# EAGLE design dualScaleBoard_HX711 (EAGLE 9.6.2)
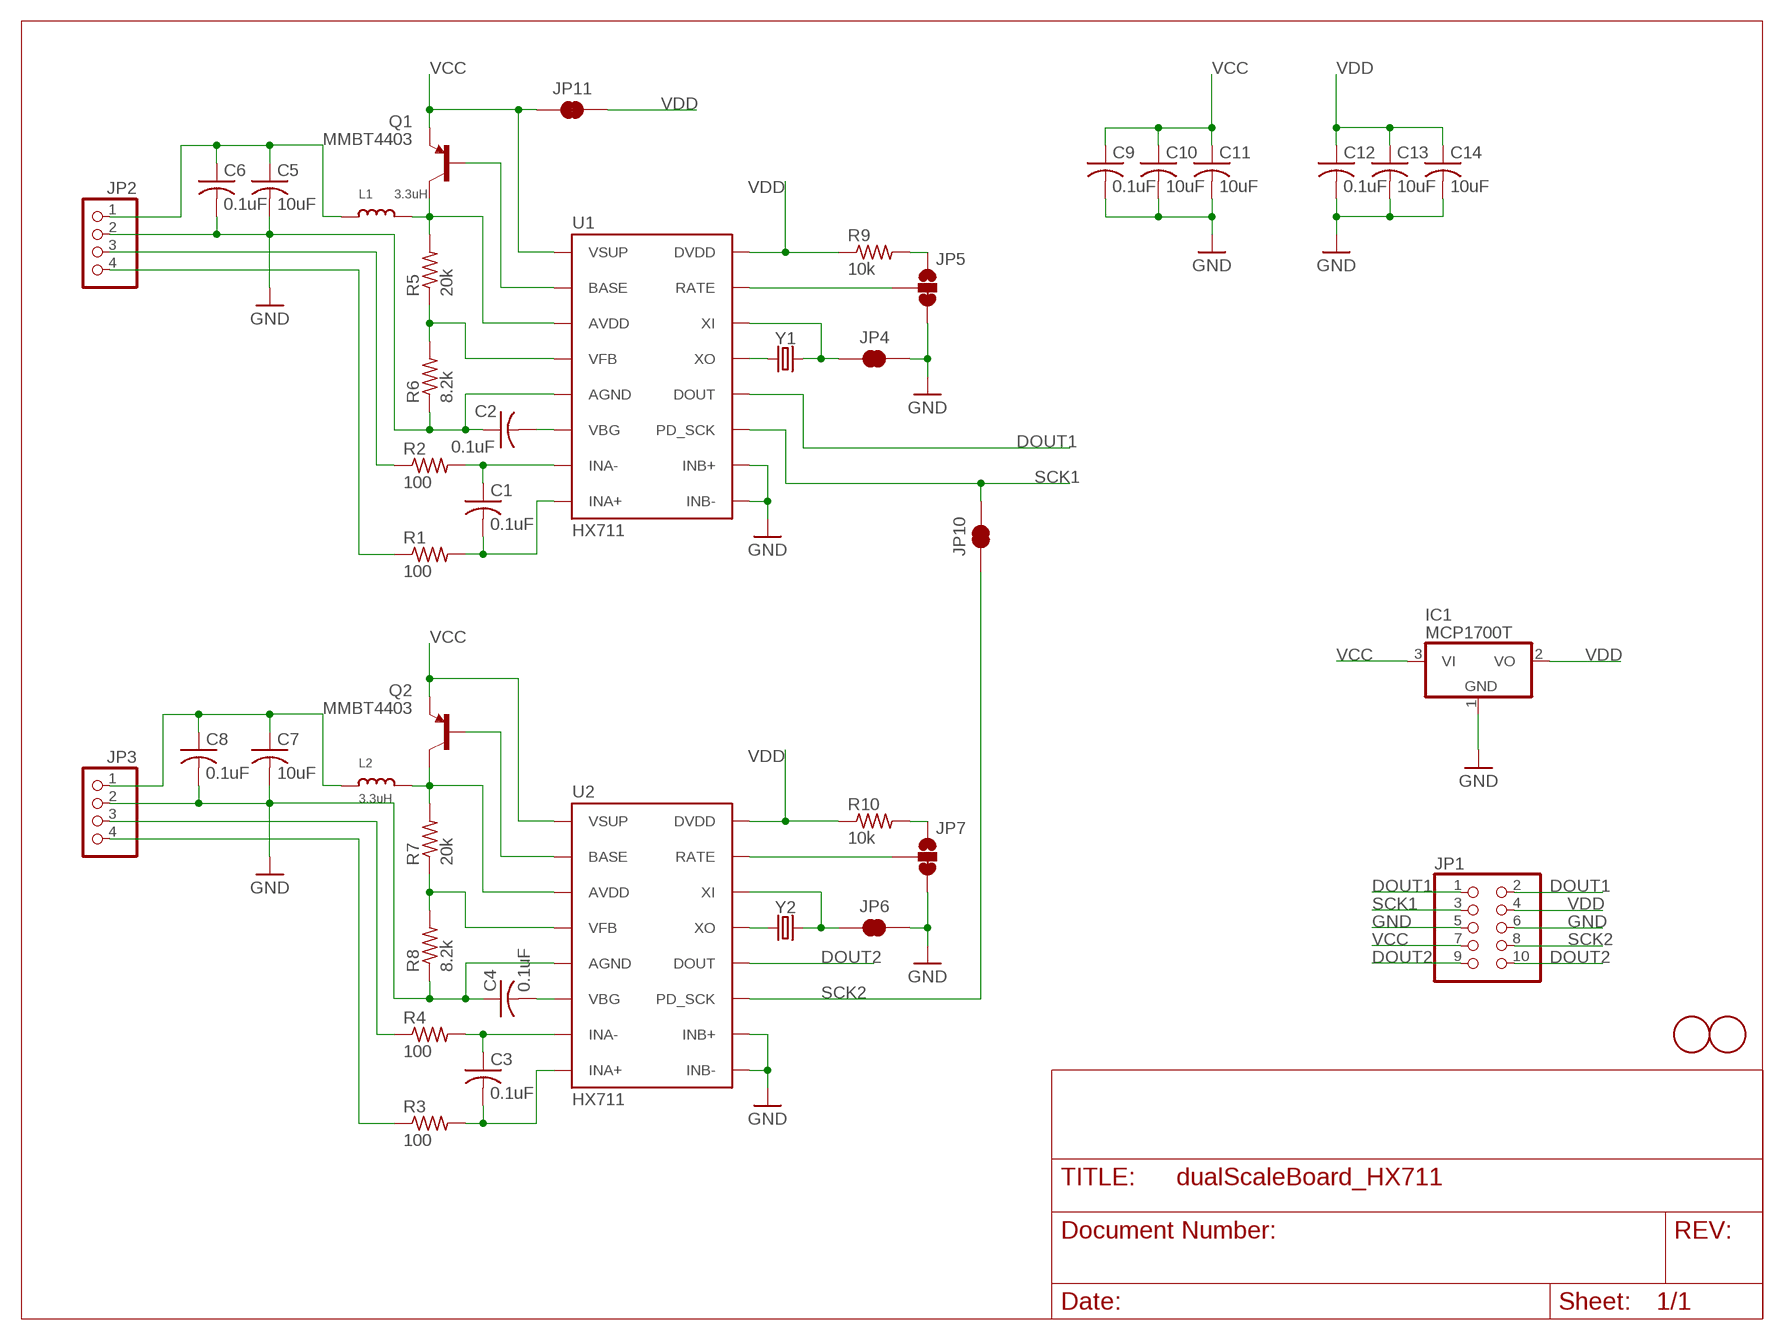
[diagram p0: schematic, sheet 1]

## Parts
C1  0.1uF  C-USC0603  [C0603]
C2  0.1uF  C-USC0603  [C0603]
C3  0.1uF  C-USC0603  [C0603]
C4  0.1uF  C-USC0603  [C0603]
C5  10uF  C-USC0603  [C0603]
C6  0.1uF  C-USC0603  [C0603]
C7  10uF  C-USC0603  [C0603]
C8  0.1uF  C-USC0603  [C0603]
C9  0.1uF  C-USC0603  [C0603]
C10  10uF  C-USC0603  [C0603]
C11  10uF  C-USC0603  [C0603]
C12  0.1uF  C-USC0603  [C0603]
C13  10uF  C-USC0603  [C0603]
C14  10uF  C-USC0603  [C0603]
IC1  MCP1700T  MCP1703CB  [SOT23]
JP1  PINHD-2X5  [2X05]
JP2  PINHD-1X4  [1X04]
JP3  PINHD-1X4  [1X04]
JP4  JUMPER-SMT_2_NC_TRACE_SILK  [SMT-JUMPER_2_NC_TRACE_SILK]
JP5  JUMPER-SMT_3_1-NC_TRACE_SILK  [SMT-JUMPER_3_1-NC_TRACE_SILK]
JP6  JUMPER-SMT_2_NC_TRACE_SILK  [SMT-JUMPER_2_NC_TRACE_SILK]
JP7  JUMPER-SMT_3_1-NC_TRACE_SILK  [SMT-JUMPER_3_1-NC_TRACE_SILK]
JP10  JUMPER-SMT_2_NC_TRACE_SILK  [SMT-JUMPER_2_NC_TRACE_SILK]
JP11  JUMPER-SMT_2_NC_TRACE_SILK  [SMT-JUMPER_2_NC_TRACE_SILK]
L1  3.3uH  INDUCTOR_0603  [_0603]
L2  3.3uH  INDUCTOR_0603  [_0603]
Q1  MMBT4403  TRANSISTOR_PNPMMBT4403  [SOT23-3]
Q2  MMBT4403  TRANSISTOR_PNPMMBT4403  [SOT23-3]
R1  100  R-US_R0402  [R0402]
R2  100  R-US_R0402  [R0402]
R3  100  R-US_R0402  [R0402]
R4  100  R-US_R0402  [R0402]
R5  20k  R-US_R0402  [R0402]
R6  8.2k  R-US_R0402  [R0402]
R7  20k  R-US_R0402  [R0402]
R8  8.2k  R-US_R0402  [R0402]
R9  10k  R-US_R0402  [R0402]
R10  10k  R-US_R0402  [R0402]
U1  HX711  [SO16]
U2  HX711  [SO16]
U$1  FIDUCIAL  [FIDUCIAL_1MM]
U$2  FIDUCIAL  [FIDUCIAL_1MM]
Y1  CRYSTALSMD-5X3.2-4PAD  [CRYSTAL-SMD-5X3.2-4PAD]
Y2  CRYSTALSMD-5X3.2-4PAD  [CRYSTAL-SMD-5X3.2-4PAD]

## Nets
DOUT1: JP1.1 JP1.2 U1.12(DOUT)
DOUT2: JP1.9 JP1.10 U2.12(DOUT)
GND: C2.1 C4.1 C5.2 C6.2 C7.2 C8.2 C9.2 C10.2 C11.2 C12.2 C13.2 C14.2 IC1.1(GND) JP1.5 JP1.6 JP2.2 JP3.2 JP4.2 JP5.3 JP6.2 JP7.3 R6.1 R8.1 U1.5(AGND) U1.9(INB-) U1.10(INB+) U2.5(AGND) U2.9(INB-) U2.10(INB+)
N$1: C2.2 U1.6(VBG)
N$2: R5.1 R6.2 U1.4(VFB)
N$3: L1.2 Q1.3(C) R5.2 U1.3(AVDD)
N$4: C1.1 R2.2 U1.7(INA-)
N$5: Q1.1(B) U1.2(BASE)
N$6: C1.2 R1.2 U1.8(INA+)
N$7: JP2.3 R2.1
N$8: JP2.4 R1.1
N$9: C5.1 C6.1 JP2.1 L1.1
N$10: C3.1 R4.2 U2.7(INA-)
N$11: C3.2 R3.2 U2.8(INA+)
N$12: U1.13(XO) Y1.1
N$13: C4.2 U2.6(VBG)
N$14: R7.1 R8.2 U2.4(VFB)
N$15: C7.1 C8.1 JP3.1 L2.1
N$16: L2.2 Q2.3(C) R7.2 U2.3(AVDD)
N$17: JP3.3 R4.1
N$18: Q2.1(B) U2.2(BASE)
N$19: JP3.4 R3.1
N$20: U2.13(XO) Y2.1
N$21: JP4.1 U1.14(XI) Y1.3
N$23: JP5.2 U1.15(RATE)
N$24: JP5.1 R9.2
N$26: JP6.1 U2.14(XI) Y2.3
N$27: JP7.2 U2.15(RATE)
N$28: JP7.1 R10.2
SCK1: JP1.3 JP10.2 U1.11(PD_SCK)
SCK2: JP1.8 JP10.1 U2.11(PD_SCK)
VCC: C9.1 C10.1 C11.1 IC1.3(VI) JP1.7 JP11.1 Q1.2(E) Q2.2(E) U1.1(VSUP) U2.1(VSUP)
VDD: C12.1 C13.1 C14.1 IC1.2(VO) JP1.4 JP11.2 R9.1 R10.1 U1.16(DVDD) U2.16(DVDD)

## Library data of the parts
C1-C4 C6 C8 C9 C12 = rcl:C-US: CAPACITOR, American symbol; LCSC: C1591; SPICEPREFIX: C
C5 C7 C10 C11 C13 C14 = rcl:C-US: CAPACITOR, American symbol; LCSC: C19702; SPICEPREFIX: C
IC1 = linear:MCP1703: 250 mA, 16V, Low Quiescent Current LDO Regulator Source: http://ww1.microchip.com/downloads/en/DeviceDoc/22049b.pdf; LCSC: C39051
JP1 = pinhead:PINHD-2X5: PIN HEADER
JP2 JP3 = pinhead:PINHD-1X4: PIN HEADER
JP4 JP6 JP10 JP11 = SparkFun-Jumpers:JUMPER-SMT_2_NC_TRACE: Normally closed trace jumper This jumper has a trace between two pads so it's normally closed (NC). Use a razor knife to open the connection. For best results follow the IPC guidelines for cutting traces: Cutout at least 0.063 mm (0.005 in). Remove all loose material to clean up the cut area. Seal the cut with an approved epoxy. Reapply solder to reclose the connection.
JP5 JP7 = SparkFun-Jumpers:JUMPER-SMT_3_1-NC_TRACE: Normally closed trace jumper (1 of 2 connections) This jumper has a trace between two pads so it's normally closed (NC). The other connection is normally open (NO). Use a razor knife to open the connection. For best results follow the IPC guidelines for cutting traces: Cutout at least 0.063 mm (0.005 in). Remove all loose material to clean up the cut area. Seal the cut with an approved epoxy. Reapply solder to reclose the connection, or to close the NO connection.
L1 L2 = microbuilder:INDUCTOR: Inductors 0603: 10nH Ceramic Inductor - microwire antenna/RF (Digikey: 712-1434-2-ND) 0805: 560nH Ceramic Inductor - RF (Digikey: 553-1047-1-ND) 270nH Ceramic Inductor - Q = 40@250MHz, +-5%, 1 Ohm DC Resistance (Digikey: 535-10506-2-ND) 1007 (2518 Metric) SMT: 10µH 10% 250mOhm 820mA 1007 Inductor (Digikey: 587-2189-1-ND) 22µH 10% 500mOhm 580mA 1007 Inductor (Digikey: 587-2190-1-ND) 47µH 10% 950mOhm 420mA 1007 Inductor (Digikey: 587-2191-1-ND) 47µH 5% 100mOhm 1A 1008 Inductor (Digikey: 732-1816-1-ND) 5.0x5.0mm (Taiyo Yuden NR5040 Series) 6.8µH 20% 2.3A 64mOhm Inductor (Digikey: 587-2374-2-ND) 5.0x5.0mm (TDK VLC5045 Series) 4.7µH 20% 3.3A 34mOhm Inductor (Digikey: 445-6526-1-ND) 6.8µH 20% 2.7A 46mOhm Inductor (Digikey: 445-6527-1-ND) 6.0x6.0mm (TDK VLC6045 Series) 4.7µH 20% 3.8A 27mOhm Inductor (Digikey: 445-6538-2-ND) 6.8µH 20% 3A 41mOhm Inductor (Digikey: 445-6540-1-ND) 6.2µH 30% 2.2A 45mOhm Inductor (Digikey: SRR5028-6R2YCT-ND) - Not TDK VLC6045 but footprint should match 6.0x6.0mm (TDK SLF6045 Series) 6.8uH 30% 2A 33mOhm Inductor (Digikey: 445-4572-1-ND, Mouser: 810-SLF645T6R8N2R0PF); LCSC: C275346
Q1 Q2 = User-Submitted:TRANSISTOR_PNP: Generic PNP BJT Double check pinouts against datasheets- not all devices are the same! MMBT3906 - 40V 200mA SOT-23 (TRANS-08052) MMBT4403 - 40V 600mA SOT-23 (TRANS-09245); LCSC: C78864; PROD_ID: TRANS-09245
R1-R4 = rcl:R-US_: RESISTOR, American symbol; LCSC: C328416; SPICEPREFIX: R
R5 R7 = rcl:R-US_: RESISTOR, American symbol; LCSC: C351700; SPICEPREFIX: R
R6 R8 = rcl:R-US_: RESISTOR, American symbol; LCSC: C517526; SPICEPREFIX: R
R9 R10 = rcl:R-US_: RESISTOR, American symbol; LCSC: C317926; SPICEPREFIX: R
U1 U2 = SparkFun-IC-Conversion:HX711: AVIA Semiconductor HX711 - ADC 24-Bit Analog-to-Digital Converter for Weigh Scales Datasheet <https://cdn.sparkfun.com/datasheets/Sensors/ForceFlex/hx711_english.pdf> SparkFun Products: SparkFun Load Cell Amplifier - HX711 <https://www.sparkfun.com/products/13879>; LCSC: C43656; PROD_ID: IC-12445
U$1 U$2 = adafruit:FIDUCIAL: For use by pick and place machines to calibrate the vision/machine, 1mm By microbuilder.eu
Y1 Y2 = SparkFun-Clocks:CRYSTAL: Crystals (Generic) These are passive quartz crystals, which can be used as a clock source for a microcontroller. Crystal's are two-terminal devices. They require external "load" capacitors to generate an oscillating signal.

## Board
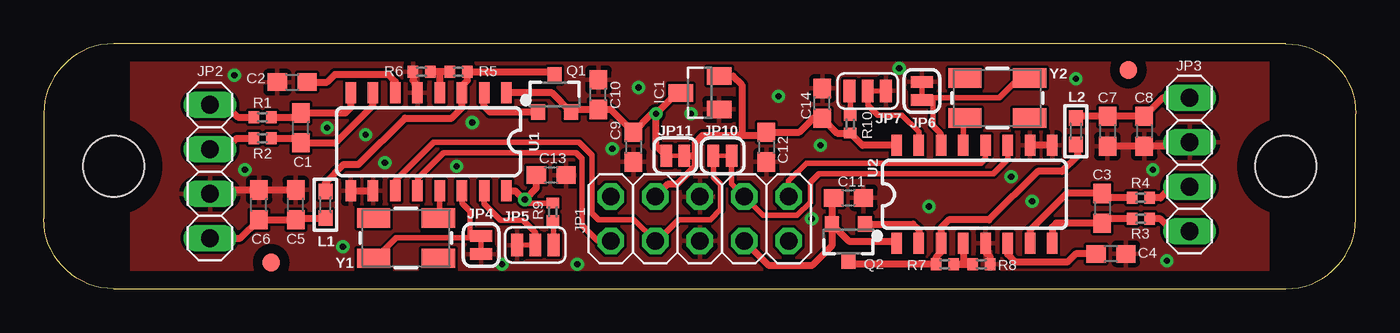
[diagram p1: board, top side]
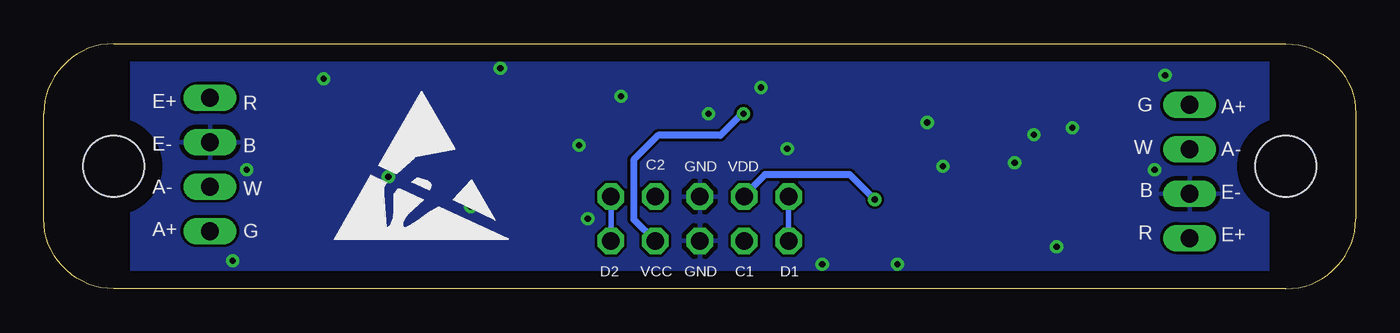
[diagram p2: board, bottom side, seen from below]

Size 75 x 14 mm. Coordinates in mm from the lower left corner, seen from the top.
Outline: 4,0 71,0 arc90 75,4 75,10 arc90 71,14 4,14 arc90 0,10 0,4 arc90 4,0
Copper layers (1*16): Top 0.035mm / dielectric 1.5mm / Bottom 0.035mm
Design rules "default": minimum track width 6mil, minimum drill 0.35mm, track to track 6mil, track to pad 6mil, pad to pad 6mil, via to via 6mil, smd to smd 6mil, copper to edge 40mil, drill to drill 6mil, minimum pad ring 10mil, minimum via ring 8mil, stop-mask expansion 4mil, vias tented up to drill 0mil, thermal gap 10mil
Holes 3.5 mm at 4,7 71,7

### Footprints (pad centres in the part's own frame; a part is rotated, then mirrored left to right if it is on the bottom)
C0603 = smd 1.1 x 1: 1 -0.85,0; 2 0.85,0
SOT23 = smd 1 x 1.4: 1 -0.95,-1.1; 2 0.95,-1.1; 3 0,1.1
2X05 = drill 1.016 octagon: 1 -5.08,-1.27; 2 -5.08,1.27; 3 -2.54,-1.27; 4 -2.54,1.27; 5 0,-1.27; 6 0,1.27; 7 2.54,-1.27; 8 2.54,1.27; 9 5.08,-1.27; 10 5.08,1.27
1X04 = drill 1.016 long: 1 -3.81,0; 2 -1.27,0; 3 1.27,0; 4 3.81,0
SMT-JUMPER_2_NC_TRACE_SILK = smd 0.66 x 1.27: 1 -0.521,0; 2 0.521,0
SMT-JUMPER_3_1-NC_TRACE_SILK = smd 0.66 x 1.27: 1 -1.041,0; 2 0,0; 3 1.041,0
_0603 = smd 0.9 x 0.8: 1 -0.762,0; 2 0.762,0
SOT23-3 = smd 0.8 x 0.9: 1 -0.95,-1; 2 0.95,-1; 3 0,1.1
R0402 = smd 0.6 x 0.7: 1 -0.5,0; 2 0.5,0
SO16 = smd 0.6 x 1.2: 1 -4.445,-2.8; 2 -3.175,-2.8; 3 -1.905,-2.8; 4 -0.635,-2.8; 5 0.635,-2.8; 6 1.905,-2.8; 7 3.175,-2.8; 8 4.445,-2.8; 9 4.445,2.8; 10 3.175,2.8; 11 1.905,2.8; 12 0.635,2.8; 13 -0.635,2.8; 14 -1.905,2.8; 15 -3.175,2.8; 16 -4.445,2.8
FIDUCIAL_1MM = smd 1 x 1: 1 0,0
CRYSTAL-SMD-5X3.2-4PAD = smd 1.9 x 1.1: 1 -1.85,-1.15; 2 1.85,-1.15; 3 1.85,1.15; 4 -1.85,1.15

### Placement (x,y rotation side)
C1  14.7,9.2 90 top
C2  14.2,11.8 0 top
C3  60.5,4.6 270 top
C4  61,2 180 top
C5  14.4,4.8 90 top
C6  12.3,4.8 90 top
C7  60.8,9 270 top
C8  62.9,9 270 top
C9  33.7,8.1 270 top
C10  31.7,11.1 90 top
C11  46,5.2 0 top
C12  41.3,8.1 270 top
C13  29,6.5 0 top
C14  44.5,10.6 90 top
IC1  37.5,11.2 90 top
JP1  37.5,4 0 top
JP2  9.5,6.7 90 top
JP3  65.5,7.1 270 top
JP4  25,2.5 270 top
JP5  28.1,2.5 180 top
JP6  50.2,11.3 90 top
JP7  47.1,11.3 0 top
JP10  38.8,7.6 180 top
JP11  36.1,7.6 0 top
L1  16.1,4.8 90 top
L2  59,9 270 top
Q1  29.2,11.1 0 top
Q2  46,2.7 180 top
R1  12.5,9.8 0 top
R2  12.5,8.6 0 top
R3  62.7,4 180 top
R4  62.7,5.2 180 top
R5  23.7,12.4 0 top
R6  21.6,12.4 0 top
R7  51.5,1.4 180 top
R8  53.6,1.4 180 top
R9  29.1,4.4 270 top
R10  46.1,9.4 90 top
U1  22,8.4 180 top
U2  53.2,5.4 0 top
U$1  13,1.5 0 top
U$2  62,12.5 0 top
U$3  [ESD_10.00]  58.5,2.7 0 bottom
Y1  20.7,2.9 180 top
Y2  54.5,10.9 0 top

### Tracks (layer width: path | path; a pad name or v marks a point on that pad's centre or on a via)
DOUT1
  Top 0.305: U1.12 21.36,6.3 22.84,7.78 30.42,7.78 30.77,7.43 30.77,3.62 31.66,2.73 JP1.1
  Bottom 0.305: JP1.2 JP1.1
DOUT2
  Top 0.305: U2.12 53.84,7.42 53.58,7.17 43.59,7.17 42.58,6.16 JP1.10
  Bottom 0.305: JP1.10 JP1.9
GND  (via drill 0.35)
  Top 0.406: JP2.2 9.72,5.65 C6.2 C5.2 | R6.1 21.1,11.89 21.36,11.63 U1.5 | JP3.2 65.48,8.15 C8.2 C7.2 | R8.1 54.1,1.83 53.84,2.09 U2.5 | U2.9 U2.10 | U1.9 U1.10
  other vias: 10.9,12.2 11.5,6.8 19.5,7.2 17.1,2.4 23.6,7 24.5,9.5 26.2,1.4 56.5,5 55.3,6.4 50.6,4.7 44.4,8.2 48.9,12.6 59,12 64.2,1.6 63.4,6.8 32.5,8 18.4,8.8 16.2,9.2 34,11.5 42,11 37,10 30.5,1.4 43.9,4
  pour Top: 5,0 5,14 70,14 70,0
  pour Bottom: 5,0 5,14 70,14 70,0
N$1
  Top 0.406: C2.2 16.19,11.8 16.65,12.26 19.67,12.26 20.09,11.84 U1.6
N$2
  Top 0.406: U1.4 22.64,12.25 22.48,12.4 R6.2 R5.1
N$3
  Top 0.406: L1.2 16.1,6.07 17.12,7.09 17.98,7.09 20.65,9.75 23.32,9.75 23.91,10.34 U1.3 23.91,11.6 24.2,11.89 R5.2 29,12.4 Q1.3
N$4
  Top 0.406: R2.2 14.45,8.6 C1.1 16.68,8.35 18.82,10.5 U1.7
N$5
  Top 0.406: U1.2 25.18,10.43 25.51,10.1 Q1.1
N$6
  Top 0.406: R1.2 14.45,9.8 C1.2 17.26,10.05 17.55,10.35 U1.8
N$7
  Top 0.406: JP2.3 10.39,7.97 11.02,8.6 R2.1
N$8
  Top 0.406: JP2.4 10.39,10.51 11.1,9.8 R1.1
N$9
  Top 0.406: JP2.1 11.24,2.89 C6.1 C5.1 14.49,4.04 L1.1
N$10
  Top 0.406: R4.2 60.75,5.2 C3.1 58.47,5.45 56.38,3.35 U2.7
N$11
  Top 0.406: R3.2 60.75,4 C3.2 57.88,3.75 57.65,3.52 U2.8
N$12
  Top 0.305: U1.13 22.64,4.11
  Top 0.406: 22.64,4.11 Y1.1
N$13
  Top 0.406: C4.2 58.99,2 58.51,1.52 55.55,1.52 55.1,1.96 U2.6
N$14
  Top 0.406: R7.1 R8.2 52.72,1.4 52.56,1.55 U2.4
N$15
  Top 0.406: JP3.1 63.96,10.91 C8.1 C7.1 59.19,9.85 L2.1
N$16
  Top 0.406: L2.2 59.1,7.6 58.21,6.71 56.81,6.71 54.04,3.94 51.74,3.94 51.3,3.5 U2.3 51.3,2.09 51,1.8 R7.2 46.2,1.4 Q2.3
N$17
  Top 0.406: JP3.3 64.47,5.83 63.84,5.2 R4.1
N$18
  Top 0.406: U2.2 50.02,3.37 49.69,3.7 Q2.1
N$19
  Top 0.406: JP3.4 65.42,3.37 64.47,3.37 63.84,4 R3.1
N$20
  Top 0.305: U2.13 52.56,9.66
  Top 0.406: 52.56,9.66 Y2.1
N$21
  Top 0.305: U1.14 23.91,4.89 24.36,4.43 24.36,3.15 24.49,3.02 JP4.1 | 18.98,1.75 20.15,2.92 24.9,2.92
  Top 0.406: JP4.1 24.9,2.92 | 18.98,1.75 Y1.3
N$23
  Top 0.305: U1.15 25.18,4.85 26.12,3.91 27.4,3.91 28.1,3.21 JP5.2
N$24
  Top 0.305: JP5.1 29.14,3.86
  Top 0.406: 29.14,3.86 R9.2
N$26
  Top 0.305: U2.14 51.3,8.85 50.84,9.3 50.84,10.65 50.71,10.78 JP6.1 | 50.33,10.91 54.62,10.91 55.76,12.05
  Top 0.406: JP6.1 50.33,10.91 | 55.76,12.05 Y2.3
N$27
  Top 0.305: U2.15 50.02,8.97 49.07,9.93 47.67,9.93 47.1,10.5 JP7.2
N$28
  Top 0.305: R10.2 46.1,11.36
  Top 0.406: 46.1,11.36 JP7.1
SCK1
  Top 0.305: U1.11 20.09,6.17 22.29,8.36 30.61,8.36 31.35,7.62 31.35,4.32 31.72,3.95 33.75,3.95 JP1.3 35.09,2.73 36.29,3.94 38.1,3.94 38.69,4.53 38.69,5.97 38.28,6.38 JP10.2
SCK2
  Top 0.305: U2.11 55.1,7.41 54.28,6.58 44.32,6.58 43.81,6.08 43.81,4.95 43.05,4.19 41.12,4.19 JP1.8 39.32,5.99 JP10.1
VCC  (via drill 0.35)
  Top 0.406: U1.1 29.05,11.2 Q1.2 30.3,10.25 C10.1 32.4,10.25 C9.1 34.75,10 v35,10 | U2.1 48.63,2.73 46.02,2.73 Q2.2 | Q2.2 45.05,2.45 43.95,1.35 41.42,1.35 JP1.7 | C11.1 45.05,5.1 Q2.2 | v35,10 36.2,11.2 IC1.3 | JP11.1 35,8.18 v35,10
  Bottom 0.406: v35,10 35.07,10 36.31,8.76 39.88,8.76 41.27,7.37 41.27,3.96 JP1.7
VDD  (via drill 0.35)
  Top 0.305: R9.1 27.7,4.9 v27.5,5.1
  Top 0.406: U2.16 46.8,8.2 R10.1 45.35,8.9 C14.1 43.99,9.75 43.19,8.95 C12.1 41.11,8.76 39.91,8.76 | 39.91,8.76 37.66,8.76 37.24,8.35 37.24,7.62 | IC1.2 39.41,12.15 39.91,11.64 39.91,8.76 | JP1.4 35.66,5.97 36.2,5.97 37.24,7.02 37.24,7.62 | U1.16 26.95,5.6 27.45,5.1 v27.5,5.1 28.15,5.75 C13.1 | JP11.2 37.22,7.6 37.24,7.62
  Bottom 0.406: JP1.4 34.96,5.33 33.77,6.51 28.91,6.51 v27.5,5.1

### Text on the board
bNames: VDD | GND | C2 | A+ / A- / E- / E+ | G / W / B / R | R / B / W / G | E+ / E- / A- / A+ | D1 | C1 | GND | VCC | D2